# EAGLE schematic RobotBooster_v1 - Kopi (EAGLE 6.1)
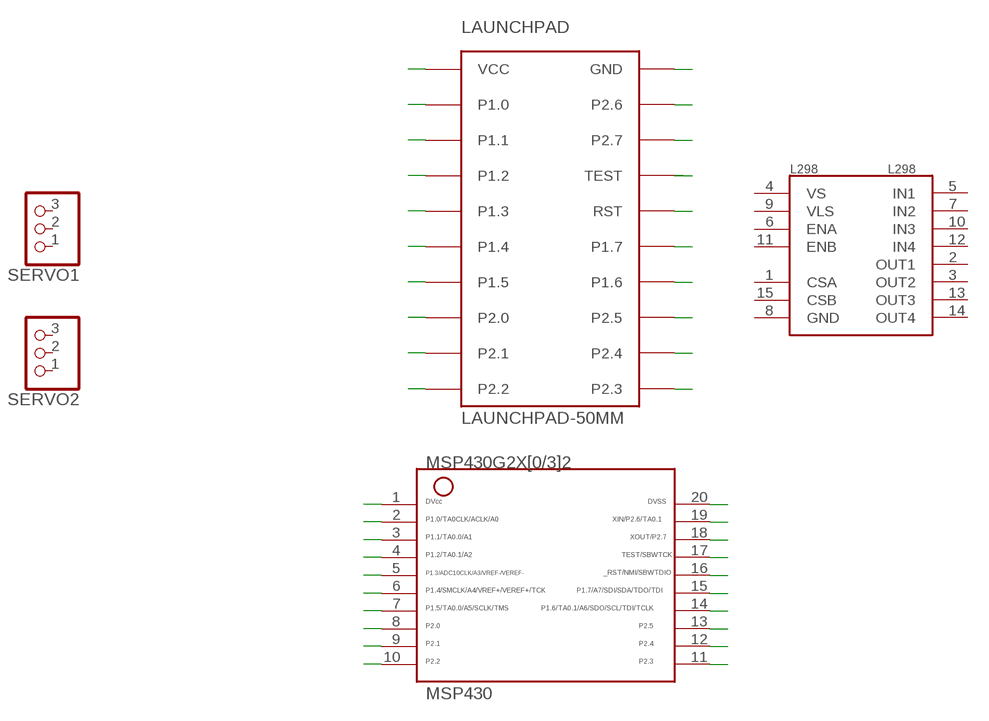
[diagram p0: schematic, sheet 1]

## Parts
L298  L298  [MULTIWATT15]
LAUNCHPAD  LAUNCHPAD-50MM  [LAUNCHPAD-50MM]
MSP430  G2X[0/3]2---N20  [N20]
SERVO1  PINHD-1X3  [1X03]
SERVO2  PINHD-1X3  [1X03]

## Nets
GND: LAUNCHPAD.GND MSP430.20
P1.0: LAUNCHPAD.P1.0 MSP430.2
P1.1: LAUNCHPAD.P1.1 MSP430.3
P1.2: LAUNCHPAD.P1.2 MSP430.4
P1.3: LAUNCHPAD.P1.3 MSP430.5
P1.4: LAUNCHPAD.P1.4 MSP430.6
P1.5: LAUNCHPAD.P1.5 MSP430.7
P1.6: LAUNCHPAD.P1.6 MSP430.14
P1.7: LAUNCHPAD.P1.7 MSP430.15
P2.0: LAUNCHPAD.P2.0 MSP430.8
P2.1: LAUNCHPAD.P2.1 MSP430.9
P2.2: LAUNCHPAD.P2.2 MSP430.10
P2.3: LAUNCHPAD.P2.3 MSP430.11
P2.4: LAUNCHPAD.P2.4 MSP430.12
P2.5: LAUNCHPAD.P2.5 MSP430.13
P2.6: LAUNCHPAD.P2.6 MSP430.19
P2.7: LAUNCHPAD.P2.7 MSP430.18
RST: LAUNCHPAD.RST MSP430.16
TEST: LAUNCHPAD.TEST MSP430.17
VCC: LAUNCHPAD.VCC MSP430.1
Unconnected: L298.1(CSA) L298.2(OUT1) L298.3(OUT2) L298.4(VS) L298.5(IN1) L298.6(ENA) L298.7(IN2) L298.8(GND) L298.9(VLS) L298.10(IN3) L298.11(ENB) L298.12(IN4) L298.13(OUT3) L298.14(OUT4) L298.15(CSB) SERVO1.1 SERVO1.2 SERVO1.3 SERVO2.1 SERVO2.2 SERVO2.3

## Library data of the parts
L298 = SparkFun-PowerIC:L298: L298 Dual Full Bridge Driver
LAUNCHPAD = TI_launchpad:LAUNCHPAD: MSP-EXP430G2 LaunchPad Booster Pack layouts. LAUNCHPAD: Full-size board LAUNCHPAD-50MM: 50x50mm board covering the button area LAUNCHPAD-50MM-LEFT: 50x50mm board leaving the button area open. Tall LaunchPad components marked on Reference for reference.
MSP430 = TI_MSP430_v16:G2X[0/3]2---N20: MSP430G2X[0/3]2 MSP430G2x32, MSP430G2x02 PDIP (N) 20 Pin Package http://focus.ti.com/docs/prod/folders/print/msp430g2432.html
SERVO1 SERVO2 = adafruit:PINHD-1X3: PIN HEADER